# Altium project Zynq7000_Eval_Board.PrjPcb (part 2 of 2)

## Sheet [04] - FPGA - DDR3, DDR3 MEM.SchDoc
size A2; SheetNumber: 4; SheetTotal: 4
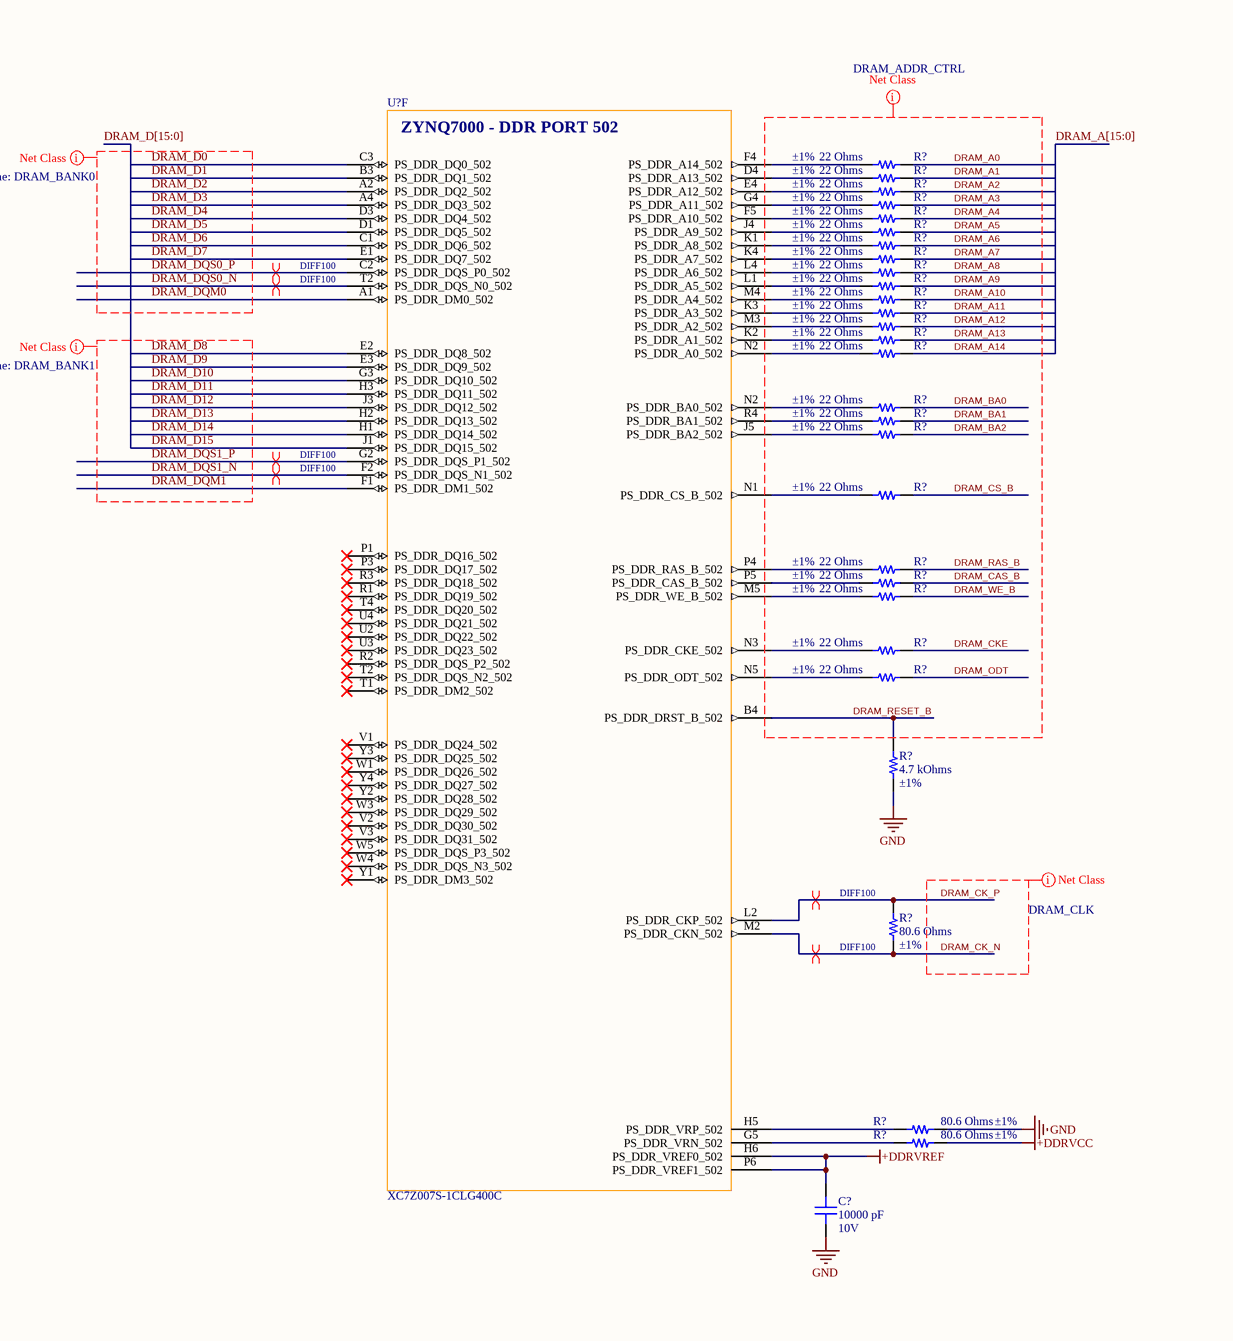
[diagram p3: [04] - FPGA - DDR3, DDR3 MEM.SchDoc, left]
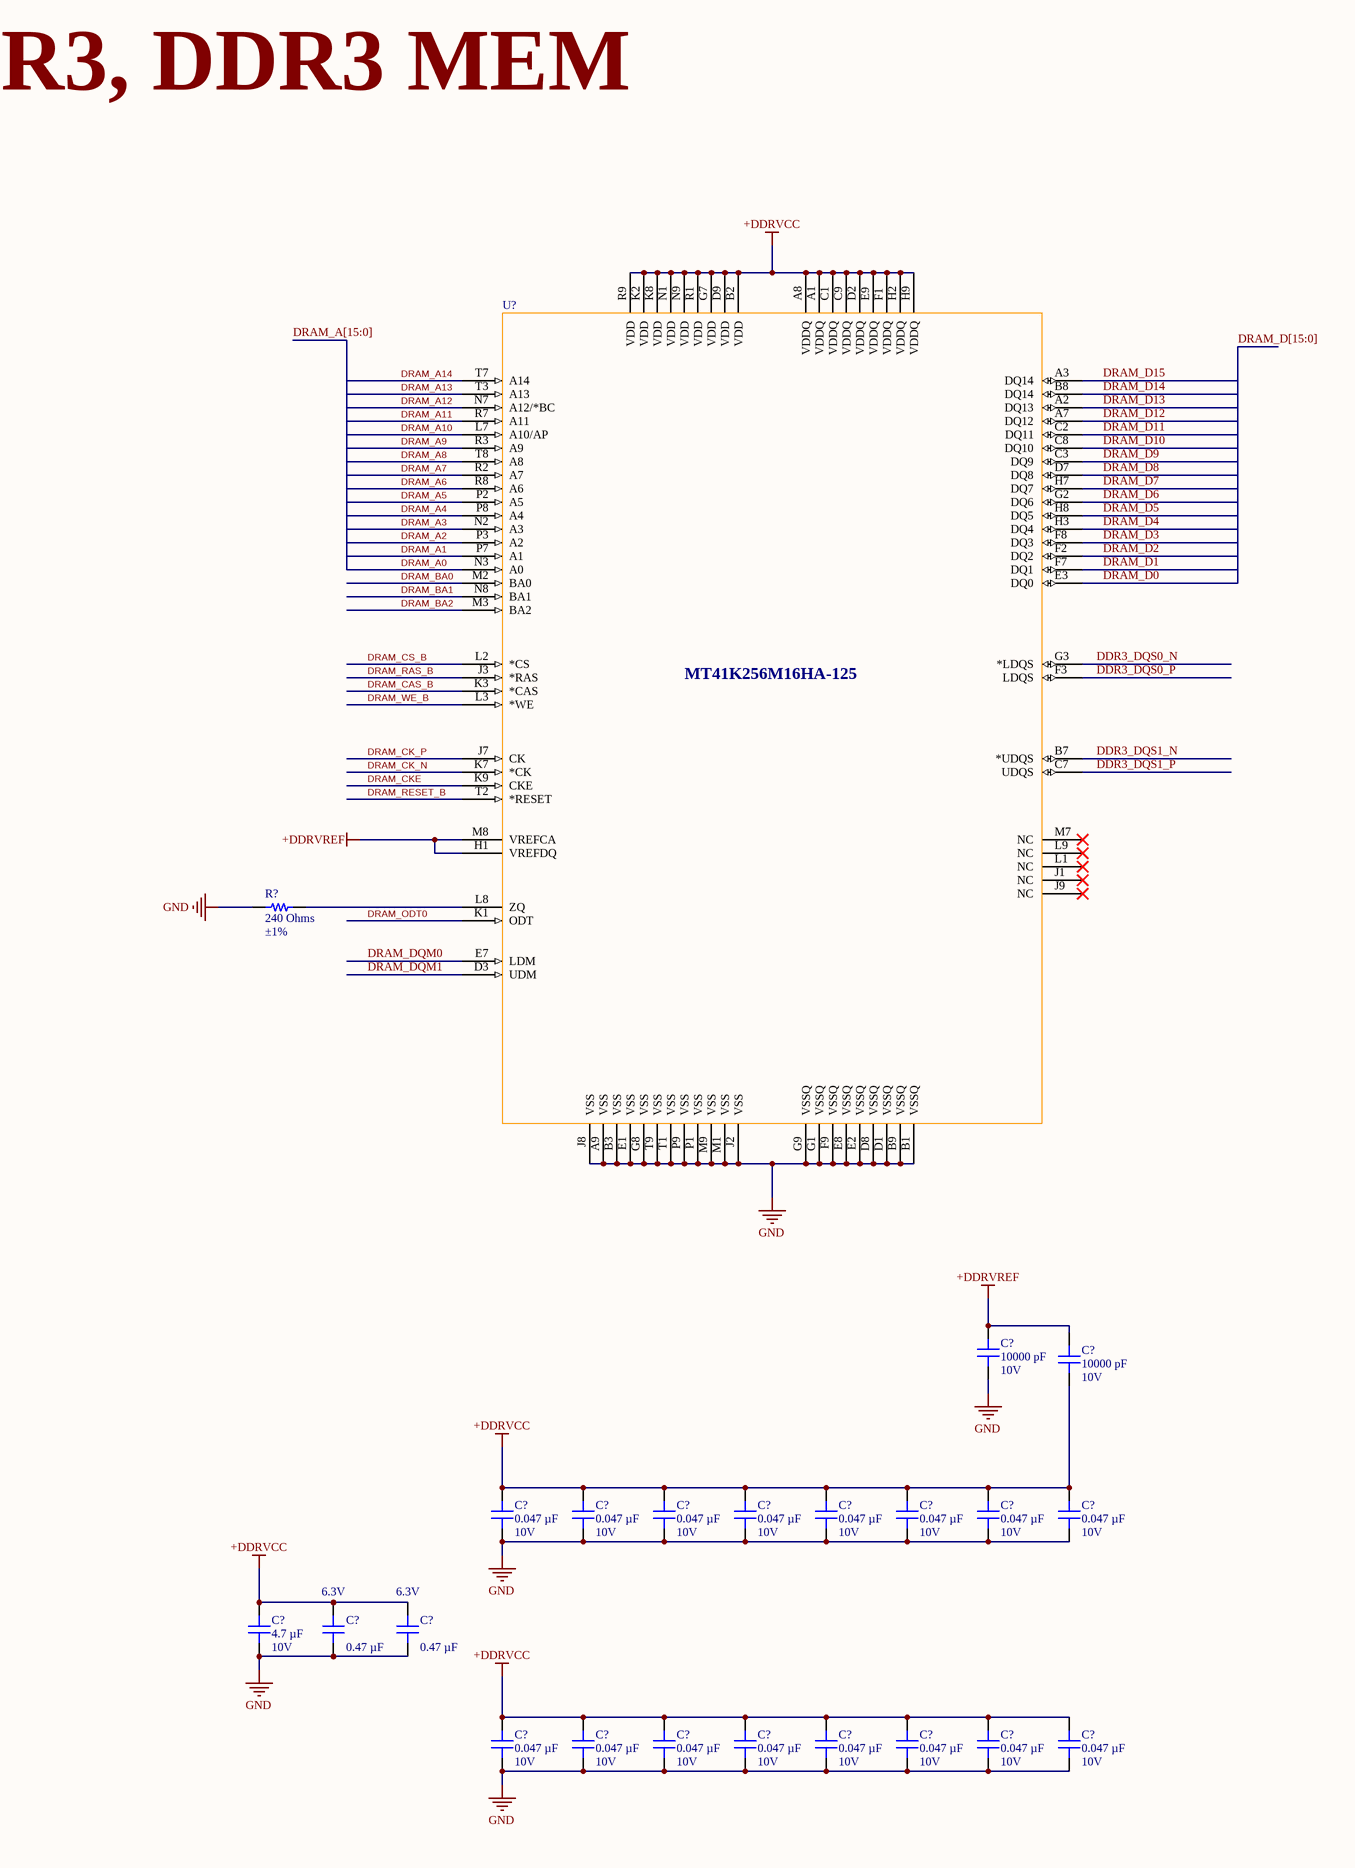
[diagram p4: [04] - FPGA - DDR3, DDR3 MEM.SchDoc, right]

### Parts
(Parts that share a designator on the sheet are numbered #1, #2 ... from top to bottom, then left to right.)
C?#75  Voltage - Rated: 10V  [CAP 0201_0603]  (hidden comment: 10000 pF)
C?#76  Voltage - Rated: 10V  [CAP 0201_0603]  (hidden comment: 10000 pF)
C?#77  Voltage - Rated: 10V  [CAP 0201_0603]  (hidden comment: 10000 pF)
C?#78  Voltage - Rated: 10V  [CAP 0201_0603]  (hidden comment: 0.047 µF)
C?#79  Voltage - Rated: 10V  [CAP 0201_0603]  (hidden comment: 0.047 µF)
C?#80  Voltage - Rated: 10V  [CAP 0201_0603]  (hidden comment: 0.047 µF)
C?#81  Voltage - Rated: 10V  [CAP 0201_0603]  (hidden comment: 0.047 µF)
C?#82  Voltage - Rated: 10V  [CAP 0201_0603]  (hidden comment: 0.047 µF)
C?#83  Voltage - Rated: 10V  [CAP 0201_0603]  (hidden comment: 0.047 µF)
C?#84  Voltage - Rated: 10V  [CAP 0201_0603]  (hidden comment: 0.047 µF)
C?#85  Voltage - Rated: 10V  [CAP 0201_0603]  (hidden comment: 0.047 µF)
C?#86  Voltage - Rated: 10V  [CAP 0402_1005]  (hidden comment: 4.7 µF)
C?#87  Voltage - Rated: 6.3V  [CAP 0201_0603]  (hidden comment: 0.47 µF)
C?#88  Voltage - Rated: 6.3V  [CAP 0201_0603]  (hidden comment: 0.47 µF)
C?#89  Voltage - Rated: 10V  [CAP 0201_0603]  (hidden comment: 0.047 µF)
C?#90  Voltage - Rated: 10V  [CAP 0201_0603]  (hidden comment: 0.047 µF)
C?#91  Voltage - Rated: 10V  [CAP 0201_0603]  (hidden comment: 0.047 µF)
C?#92  Voltage - Rated: 10V  [CAP 0201_0603]  (hidden comment: 0.047 µF)
C?#93  Voltage - Rated: 10V  [CAP 0201_0603]  (hidden comment: 0.047 µF)
C?#94  Voltage - Rated: 10V  [CAP 0201_0603]  (hidden comment: 0.047 µF)
C?#95  Voltage - Rated: 10V  [CAP 0201_0603]  (hidden comment: 0.047 µF)
C?#96  Voltage - Rated: 10V  [CAP 0201_0603]  (hidden comment: 0.047 µF)
R?#21  Tolerance: ±1%  [RES 0201_0603]  (hidden comment: 22 Ohms)
R?#22  Tolerance: ±1%  [RES 0201_0603]  (hidden comment: 22 Ohms)
R?#23  Tolerance: ±1%  [RES 0201_0603]  (hidden comment: 22 Ohms)
R?#24  Tolerance: ±1%  [RES 0201_0603]  (hidden comment: 22 Ohms)
R?#25  Tolerance: ±1%  [RES 0201_0603]  (hidden comment: 22 Ohms)
R?#26  Tolerance: ±1%  [RES 0201_0603]  (hidden comment: 22 Ohms)
R?#27  Tolerance: ±1%  [RES 0201_0603]  (hidden comment: 22 Ohms)
R?#28  Tolerance: ±1%  [RES 0201_0603]  (hidden comment: 22 Ohms)
R?#29  Tolerance: ±1%  [RES 0201_0603]  (hidden comment: 22 Ohms)
R?#30  Tolerance: ±1%  [RES 0201_0603]  (hidden comment: 22 Ohms)
R?#31  Tolerance: ±1%  [RES 0201_0603]  (hidden comment: 22 Ohms)
R?#32  Tolerance: ±1%  [RES 0201_0603]  (hidden comment: 22 Ohms)
R?#33  Tolerance: ±1%  [RES 0201_0603]  (hidden comment: 22 Ohms)
R?#34  Tolerance: ±1%  [RES 0201_0603]  (hidden comment: 22 Ohms)
R?#35  Tolerance: ±1%  [RES 0201_0603]  (hidden comment: 22 Ohms)
R?#36  Tolerance: ±1%  [RES 0201_0603]  (hidden comment: 22 Ohms)
R?#37  Tolerance: ±1%  [RES 0201_0603]  (hidden comment: 22 Ohms)
R?#38  Tolerance: ±1%  [RES 0201_0603]  (hidden comment: 22 Ohms)
R?#39  Tolerance: ±1%  [RES 0201_0603]  (hidden comment: 22 Ohms)
R?#40  Tolerance: ±1%  [RES 0201_0603]  (hidden comment: 22 Ohms)
R?#41  Tolerance: ±1%  [RES 0201_0603]  (hidden comment: 22 Ohms)
R?#42  Tolerance: ±1%  [RES 0201_0603]  (hidden comment: 22 Ohms)
R?#43  Tolerance: ±1%  [RES 0201_0603]  (hidden comment: 22 Ohms)
R?#44  Tolerance: ±1%  [RES 0201_0603]  (hidden comment: 22 Ohms)
R?#45  Tolerance: ±1%  [RES 0402_1005]  (hidden comment: 240 Ohms)
R?#46  Tolerance: ±1%  [RES 0402_1005]  (hidden comment: 4.7 kOhms)
R?#47  Tolerance: ±1%  [RES 0402_1005]  (hidden comment: 80.6 Ohms)
R?#48  Tolerance: ±1%  [RES 0402_1005]  (hidden comment: 80.6 Ohms)
R?#49  Tolerance: ±1%  [RES 0402_1005]  (hidden comment: 80.6 Ohms)
U?#4  XC7Z007S-1CLG400C  [CLG400_XIL]  (part F of 8)
U?#5  MT41K256M16HA-125

### Nets
+DDRVCC: C?#76.1 C?#78.2 C?#79.2 C?#80.2 C?#81.2 C?#82.2 C?#83.2 C?#84.2 C?#85.2 C?#86.2 C?#87.2 C?#88.2 C?#89.2 C?#90.2 C?#91.2 C?#92.2 C?#93.2 C?#94.2 C?#95.2 C?#96.2 R?#49.2 U?#5.A1(VDDQ) U?#5.A8(VDDQ) U?#5.B2(VDD) U?#5.C1(VDDQ) U?#5.C9(VDDQ) U?#5.D2(VDDQ) U?#5.D9(VDD) U?#5.E9(VDDQ) U?#5.F1(VDDQ) U?#5.G7(VDD) U?#5.H2(VDDQ) U?#5.H9(VDDQ) U?#5.K2(VDD) U?#5.K8(VDD) U?#5.N1(VDD) U?#5.N9(VDD) U?#5.R1(VDD) U?#5.R9(VDD)
+DDRVREF: C?#75.2 C?#76.2 C?#77.2 U?#4.H6(PS_DDR_VREF0_502) U?#4.P6(PS_DDR_VREF1_502) U?#5.H1(VREFDQ) U?#5.M8(VREFCA)
GND: C?#75.1 C?#77.1 C?#78.1 C?#79.1 C?#80.1 C?#81.1 C?#82.1 C?#83.1 C?#84.1 C?#85.1 C?#86.1 C?#87.1 C?#88.1 C?#89.1 C?#90.1 C?#91.1 C?#92.1 C?#93.1 C?#94.1 C?#95.1 C?#96.1 R?#45.1 R?#46.2 R?#48.2 U?#5.A9(VSS) U?#5.B1(VSSQ) U?#5.B3(VSS) U?#5.B9(VSSQ) U?#5.D1(VSSQ) U?#5.D8(VSSQ) U?#5.E1(VSS) U?#5.E2(VSSQ) U?#5.E8(VSSQ) U?#5.F9(VSSQ) U?#5.G1(VSSQ) U?#5.G8(VSS) U?#5.G9(VSSQ) U?#5.J2(VSS) U?#5.J8(VSS) U?#5.M1(VSS) U?#5.M9(VSS) U?#5.P1(VSS) U?#5.P9(VSS) U?#5.T1(VSS) U?#5.T9(VSS)
DDR3_DQS0_N: U?#5.G3(*LDQS)
DDR3_DQS0_P: U?#5.F3(LDQS)
DDR3_DQS1_N: U?#5.B7(*UDQS)
DDR3_DQS1_P: U?#5.C7(UDQS)
DRAM_A0: R?#21.1 U?#5.N3(A0)
DRAM_A1: R?#22.1 U?#5.P7(A1)
DRAM_A2: R?#23.1 U?#5.P3(A2)
DRAM_A3: R?#24.1 U?#5.N2(A3)
DRAM_A4: R?#25.1 U?#5.P8(A4)
DRAM_A5: R?#26.1 U?#5.P2(A5)
DRAM_A6: R?#27.1 U?#5.R8(A6)
DRAM_A7: R?#28.1 U?#5.R2(A7)
DRAM_A8: R?#29.1 U?#5.T8(A8)
DRAM_A9: R?#30.1 U?#5.R3(A9)
DRAM_A10: R?#31.1 U?#5.L7(A10/AP)
DRAM_A11: R?#32.1 U?#5.R7(A11)
DRAM_A12: R?#33.1 U?#5.N7(A12/*BC)
DRAM_A13: R?#34.1 U?#5.T3(A13)
DRAM_A14: R?#35.1 U?#5.T7(A14)
DRAM_BA0: R?#36.1 U?#5.M2(BA0)
DRAM_BA1: R?#37.1 U?#5.N8(BA1)
DRAM_BA2: R?#38.1 U?#5.M3(BA2)
DRAM_CAS_B: R?#41.1 U?#5.K3(*CAS)
DRAM_CK_N: R?#47.2 U?#4.M2(PS_DDR_CKN_502) U?#5.K7(*CK)
DRAM_CK_P: R?#47.1 U?#4.L2(PS_DDR_CKP_502) U?#5.J7(CK)
DRAM_CKE: R?#43.1 U?#5.K9(CKE)
DRAM_CS_B: R?#39.1 U?#5.L2(*CS)
DRAM_D0: U?#4.C3(PS_DDR_DQ0_502) U?#5.E3(DQ0)
DRAM_D1: U?#4.B3(PS_DDR_DQ1_502) U?#5.F7(DQ1)
DRAM_D2: U?#4.A2(PS_DDR_DQ2_502) U?#5.F2(DQ2)
DRAM_D3: U?#4.A4(PS_DDR_DQ3_502) U?#5.F8(DQ3)
DRAM_D4: U?#4.D3(PS_DDR_DQ4_502) U?#5.H3(DQ4)
DRAM_D5: U?#4.D1(PS_DDR_DQ5_502) U?#5.H8(DQ5)
DRAM_D6: U?#4.C1(PS_DDR_DQ6_502) U?#5.G2(DQ6)
DRAM_D7: U?#4.E1(PS_DDR_DQ7_502) U?#5.H7(DQ7)
DRAM_D8: U?#4.E2(PS_DDR_DQ8_502) U?#5.D7(DQ8)
DRAM_D9: U?#4.E3(PS_DDR_DQ9_502) U?#5.C3(DQ9)
DRAM_D10: U?#4.G3(PS_DDR_DQ10_502) U?#5.C8(DQ10)
DRAM_D11: U?#4.H3(PS_DDR_DQ11_502) U?#5.C2(DQ11)
DRAM_D12: U?#4.J3(PS_DDR_DQ12_502) U?#5.A7(DQ12)
DRAM_D13: U?#4.H2(PS_DDR_DQ13_502) U?#5.A2(DQ13)
DRAM_D14: U?#4.H1(PS_DDR_DQ14_502) U?#5.B8(DQ14)
DRAM_D15: U?#4.J1(PS_DDR_DQ15_502) U?#5.A3(DQ14)
DRAM_DQM0: U?#4.A1(PS_DDR_DM0_502) U?#5.E7(LDM)
DRAM_DQM1: U?#4.F1(PS_DDR_DM1_502) U?#5.D3(UDM)
DRAM_DQS0_N: U?#4.T2(PS_DDR_DQS_N2_502)
DRAM_DQS0_P: U?#4.C2(PS_DDR_DQS_P0_502)
DRAM_DQS1_N: U?#4.F2(PS_DDR_DQS_N1_502)
DRAM_DQS1_P: U?#4.G2(PS_DDR_DQS_P1_502)
DRAM_ODT: R?#44.1
DRAM_ODT0: U?#5.K1(ODT)
DRAM_RAS_B: R?#40.1 U?#5.J3(*RAS)
DRAM_RESET_B: R?#46.1 U?#4.B4(PS_DDR_DRST_B_502) U?#5.T2(*RESET)
DRAM_WE_B: R?#42.1 U?#5.L3(*WE)
NetR?#21_2: R?#21.2 U?#4.F4(PS_DDR_A14_502)
NetR?#22_2: R?#22.2 U?#4.D4(PS_DDR_A13_502)
NetR?#23_2: R?#23.2 U?#4.E4(PS_DDR_A12_502)
NetR?#24_2: R?#24.2 U?#4.G4(PS_DDR_A11_502)
NetR?#25_2: R?#25.2 U?#4.F5(PS_DDR_A10_502)
NetR?#26_2: R?#26.2 U?#4.J4(PS_DDR_A9_502)
NetR?#27_2: R?#27.2 U?#4.K1(PS_DDR_A8_502)
NetR?#28_2: R?#28.2 U?#4.K4(PS_DDR_A7_502)
NetR?#29_2: R?#29.2 U?#4.L4(PS_DDR_A6_502)
NetR?#30_2: R?#30.2 U?#4.L1(PS_DDR_A5_502)
NetR?#31_2: R?#31.2 U?#4.M4(PS_DDR_A4_502)
NetR?#32_2: R?#32.2 U?#4.K3(PS_DDR_A3_502)
NetR?#33_2: R?#33.2 U?#4.M3(PS_DDR_A2_502)
NetR?#34_2: R?#34.2 U?#4.K2(PS_DDR_A1_502)
NetR?#35_2: R?#35.2 U?#4.N2(PS_DDR_A0_502)
NetR?#36_2: R?#36.2 U?#4.N2(PS_DDR_BA0_502)
NetR?#37_2: R?#37.2 U?#4.R4(PS_DDR_BA1_502)
NetR?#38_2: R?#38.2 U?#4.J5(PS_DDR_BA2_502)
NetR?#39_2: R?#39.2 U?#4.N1(PS_DDR_CS_B_502)
NetR?#40_2: R?#40.2 U?#4.P4(PS_DDR_RAS_B_502)
NetR?#41_2: R?#41.2 U?#4.P5(PS_DDR_CAS_B_502)
NetR?#42_2: R?#42.2 U?#4.M5(PS_DDR_WE_B_502)
NetR?#43_2: R?#43.2 U?#4.N3(PS_DDR_CKE_502)
NetR?#44_2: R?#44.2 U?#4.N5(PS_DDR_ODT_502)
NetR?#45_2: R?#45.2 U?#5.L8(ZQ)
NetR?#48_1: R?#48.1 U?#4.H5(PS_DDR_VRP_502)
NetR?#49_1: R?#49.1 U?#4.G5(PS_DDR_VRN_502)

Not connected (* = marked no-connect by the designer): U?#4 P1(PS_DDR_DQ16_502)* P3(PS_DDR_DQ17_502)* R1(PS_DDR_DQ19_502)* R2(PS_DDR_DQS_P2_502)* R3(PS_DDR_DQ18_502)* T1(PS_DDR_DM2_502)* T4(PS_DDR_DQ20_502)* U2(PS_DDR_DQ22_502)* U3(PS_DDR_DQ23_502)* U4(PS_DDR_DQ21_502)* V1(PS_DDR_DQ24_502)* V2(PS_DDR_DQ30_502)* V3(PS_DDR_DQ31_502)* W1(PS_DDR_DQ26_502)* W3(PS_DDR_DQ29_502)* W4(PS_DDR_DQS_N3_502)* W5(PS_DDR_DQS_P3_502)* Y1(PS_DDR_DM3_502)* Y2(PS_DDR_DQ28_502)* Y3(PS_DDR_DQ25_502)* Y4(PS_DDR_DQ27_502)*; U?#5 J1(NC)* J9(NC)* L1(NC)* L9(NC)* M7(NC)*

### Buses and harness runs
bus DRAM_A[15:0]
bus DRAM_D[15:0]

### Layout directives
Net Class Name: DRAM_ADDR_CTRL: DRAM_A0, DRAM_A1, DRAM_A2, DRAM_A3, DRAM_A4, DRAM_A5, DRAM_A6, DRAM_A7, DRAM_A8, DRAM_A9, DRAM_A10, DRAM_A11, DRAM_A12, DRAM_A13, DRAM_A14, DRAM_BA0, DRAM_BA1, DRAM_BA2, DRAM_CAS_B, DRAM_CKE, DRAM_CS_B, DRAM_ODT, DRAM_RAS_B, DRAM_RESET_B, DRAM_WE_B
Net Class Name: DRAM_BANK0: DRAM_D0, DRAM_D1, DRAM_D2, DRAM_D3, DRAM_D4, DRAM_D5, DRAM_D6, DRAM_D7, DRAM_DQM0, DRAM_DQS0_N, DRAM_DQS0_P
Net Class Name: DRAM_BANK1: DRAM_D8, DRAM_D9, DRAM_D10, DRAM_D11, DRAM_D12, DRAM_D13, DRAM_D14, DRAM_D15, DRAM_DQM1, DRAM_DQS1_N, DRAM_DQS1_P
differential pair; net class DIFF100: DRAM_CK_N, DRAM_CK_P, DRAM_DQS0_N, DRAM_DQS0_P, DRAM_DQS1_N, DRAM_DQS1_P
Net Class Name: DRAM_CLK: DRAM_CK_N, DRAM_CK_P

### Notes on the sheet
- FPGA - DDR3, DDR3 MEM
- (in symbol XC7Z007S-1CLG400C, part F) ZYNQ7000 - DDR PORT 502

### Library data of the parts
C?#75-C?#77 = MAASL063SB7103MFCA01: CAP CER 0.01UF 10V X7R 0201; manufacturer: Taiyo Yuden; Tolerance: ±20%; Part Number: MAASL063SB7103MFCA01; Value: 10000 pF; Applications: Automotive; Capacitance: 10000 pF; componentlink1description: Datasheet; componentlink1url: https://media.digikey.com/pdf/Data%20Sheets/Taiyo%20Yuden%20PDFs%20URL%20links/MAASL063SB7103MFCA01_SS.pdf; componentlink2description: DigiKey Link; componentlink2url: https://www.digikey.com/en/products/detail/taiyo-yuden/MAASL063SB7103MFCA01/18109005; Device Package: 0201 (0603 Metric); Height - Seated (Max): 0.013" (0.33mm); lastupdated: 27.04.2023 19:00:59; Lifecycle Status: Active; Minimum Order: 1; Mounting Type: Surface Mount, MLCC; Operating Temperature: -55°C ~ 125°C; Package / Case: 0201 (0603 Metric); packaging: TapeAndReel; partid: 47946; Part Status: Active; price: 0.01; Ratings: AEC-Q200; series: MAAS; Size / Dimension: 0.024" L x 0.012" W (0.60mm x 0.30mm); Supplier 1: DigiKey; Supplier Part Number 1: 587-MAASL063SB7103MFCA01CT-ND; Temperature Coefficient: X7R; Thickness (Max): 0.013" (0.33mm)
C?#78-C?#85 C?#89-C?#96 = LMK063BJ473KP-F: CAP CER 0.047UF 10V X5R 0201; manufacturer: Taiyo Yuden; Tolerance: ±10%; Part Number: LMK063BJ473KP-F; Value: 0.047 µF; Applications: SMPS Filtering; Capacitance: 0.047 µF; componentlink1description: Datasheet; componentlink1url: https://ds.yuden.co.jp/TYCOMPAS/ut/detail?pn=LMK063BJ473KP-F  &u=M; componentlink2description: DigiKey Link; componentlink2url: https://www.digikey.com/en/products/detail/taiyo-yuden/LMK063BJ473KP-F/2002857; Device Package: 0201 (0603 Metric); lastupdated: 27.04.2023 19:01:19; Lifecycle Status: Active; Minimum Order: 1; Mounting Type: Surface Mount, MLCC; Operating Temperature: -55°C ~ 85°C; Package / Case: 0201 (0603 Metric); packaging: TapeAndReel; partid: 223; Part Status: Active; price: 0.01; series: M; Size / Dimension: 0.024" L x 0.012" W (0.60mm x 0.30mm); Supplier 1: DigiKey; Supplier Part Number 1: 587-2242-1-ND; Temperature Coefficient: X5R; Thickness (Max): 0.013" (0.33mm)
C?#86 = GMC04X5R475K10NT: CAP0402 X5R 4.7UF 10% 10V; manufacturer: Cal-Chip Electronics, Inc.; Part Number: GMC04X5R475K10NT; Value: 4.7 µF; Applications: General Purpose; Capacitance: 4.7 µF; componentlink1description: Datasheet; componentlink1url: https://88ce57.p3cdn1.secureserver.net/wp-content/uploads/2023/01/gmc_series-2.pdf; componentlink2description: DigiKey Link; componentlink2url: https://www.digikey.com/en/products/detail/cal-chip-electronics-inc/GMC04X5R475K10NT/18151135; Device Package: 0402 (1005 Metric); lastupdated: 26.04.2023 19:01:59; Lifecycle Status: Active; Minimum Order: 1; Mounting Type: Surface Mount, MLCC; Operating Temperature: -55°C ~ 85°C; Package / Case: 0402 (1005 Metric); packaging: TapeAndReel; partid: 49814; Part Status: Active; price: 0.01; series: GMC; Size / Dimension: 0.039" L x 0.020" W (1.00mm x 0.50mm); Supplier 1: DigiKey; Supplier Part Number 1: 4713-GMC04X5R475K10NTCT-ND; Temperature Coefficient: X5R; Thickness (Max): 0.028" (0.70mm); Tolerance: ±10%
C?#87 C?#88 = JMK063BC6474KP-F: CAP CER 0.47UF 6.3V X6S 0201; manufacturer: Taiyo Yuden; Tolerance: ±10%; Part Number: JMK063BC6474KP-F; Value: 0.47 µF; Applications: SMPS Filtering; Capacitance: 0.47 µF; componentlink1description: Datasheet; componentlink1url: https://ds.yuden.co.jp/TYCOMPAS/ut/detail?pn=JMK063BC6474KP-F&u=M; componentlink2description: DigiKey Link; componentlink2url: https://www.digikey.com/en/products/detail/taiyo-yuden/JMK063BC6474KP-F/9947925; Device Package: 0201 (0603 Metric); lastupdated: 26.04.2023 19:00:46; Lifecycle Status: Active; Minimum Order: 1; Mounting Type: Surface Mount, MLCC; Operating Temperature: -55°C ~ 105°C; Package / Case: 0201 (0603 Metric); packaging: TapeAndReel; partid: 108; Part Status: Active; price: 0.01; series: M; Size / Dimension: 0.024" L x 0.012" W (0.60mm x 0.30mm); Supplier 1: DigiKey; Supplier Part Number 1: 587-6386-1-ND; Temperature Coefficient: X6S; Thickness (Max): 0.015" (0.39mm)
R?#21-R?#44 = ERJ-1GNF22R0C: RES SMD 22 OHM 1% 1/20W 0201; Manufacturer: Panasonic Electronic Components; Power (Watts): 0.05W, 1/20W; Temperature Coefficient: ±200ppm/°C; Part Number: ERJ-1GNF22R0C; Value: 22 Ohms; ComponentLink1Description: Datasheet; ComponentLink1URL: https://industrial.panasonic.com/cdbs/www-data/pdf/RDA0000/AOA0000C304.pdf; ComponentLink2Description: DigiKey Link; ComponentLink2URL: https://www.digikey.com/en/products/detail/panasonic-electronic-components/ERJ-1GNF22R0C/2035920; Composition: Thick Film; Device Package: 0201 (0603 Metric); Features: Automotive AEC-Q200; Height - Seated (Max): 0.010" (0.26mm); LastUpdated: 29.04.2023 19:19:39; Lifecycle Status: Active; Minimum Order: 1; Number of Terminations: 2; Operating Temperature: -55°C ~ 125°C; Package / Case: 0201 (0603 Metric); Packaging: TapeAndReel; PartId: 823; Part Status: Active; Price: 0.01; Ratings: AEC-Q200; Resistance: 22 Ohms; Series: ERJ-1GN; Size / Dimension: 0.024" L x 0.012" W (0.60mm x 0.30mm); Supplier 1: DigiKey; Supplier Part Number 1: P122843CT-ND; Supplier Device Package: 0201
R?#45 = RMCF0402FT240R: RES 240 OHM 1% 1/16W 0402; Manufacturer: Stackpole Electronics Inc; Power (Watts): 0.063W, 1/16W; Temperature Coefficient: ±100ppm/°C; Part Number: RMCF0402FT240R; Value: 240 Ohms; ComponentLink1Description: Datasheet; ComponentLink1URL: https://www.seielect.com/catalog/sei-rmcf_rmcp.pdf; ComponentLink2Description: DigiKey Link; ComponentLink2URL: https://www.digikey.com/en/products/detail/stackpole-electronics-inc/RMCF0402FT240R/2417437; Composition: Thick Film; Device Package: 0402 (1005 Metric); Features: Automotive AEC-Q200; Height - Seated (Max): 0.016" (0.40mm); LastUpdated: 1.05.2023 19:23:08; Lifecycle Status: Active; Minimum Order: 1; Number of Terminations: 2; Operating Temperature: -55°C ~ 155°C; Package / Case: 0402 (1005 Metric); Packaging: CutTape; PartId: 4938; Part Status: Active; Price: 0.01; Ratings: AEC-Q200; Resistance: 240 Ohms; Series: RMCF; Size / Dimension: 0.039" L x 0.020" W (1.00mm x 0.50mm); Supplier 1: DigiKey; Supplier Part Number 1: RMCF0402FT240RCT-ND; Supplier Device Package: 0402
R?#46 = RT0402FRE074K7L: RES SMD 4.7K OHM 1% 1/16W 0402; Manufacturer: Yageo; Power (Watts): 0.063W, 1/16W; Temperature Coefficient: ±50ppm/°C; Part Number: RT0402FRE074K7L; Value: 4.7 kOhms; ComponentLink1Description: Datasheet; ComponentLink1URL: https://www.yageo.com/upload/media/product/productsearch/datasheet/rchip/PYu-RT_1-to-0.01_RoHS_L_11.pdf; ComponentLink2Description: DigiKey Link; ComponentLink2URL: https://www.digikey.com/en/products/detail/yageo/RT0402FRE074K7L/1072052; Composition: Thin Film; Device Package: 0402 (1005 Metric); Height - Seated (Max): 0.014" (0.35mm); LastUpdated: 1.05.2023 19:23:11; Lifecycle Status: Active; Minimum Order: 1; Number of Terminations: 2; Operating Temperature: -55°C ~ 155°C; Package / Case: 0402 (1005 Metric); Packaging: TapeAndReel; PartId: 3198; Part Status: Active; Price: 0.01; Resistance: 4.7 kOhms; Series: RT; Size / Dimension: 0.039" L x 0.020" W (1.00mm x 0.50mm); Supplier 1: DigiKey; Supplier Part Number 1: YAG3347CT-ND; Supplier Device Package: 0402
R?#47-R?#49 = CRCW040280R6FKED: RES SMD 80.6 OHM 1% 1/16W 0402; Manufacturer: Vishay Dale; Power (Watts): 0.063W, 1/16W; Temperature Coefficient: ±100ppm/°C; Part Number: CRCW040280R6FKED; Value: 80.6 Ohms; ComponentLink1Description: Datasheet; ComponentLink1URL: http://www.vishay.com/docs/20035/dcrcwe3.pdf; ComponentLink2Description: DigiKey Link; ComponentLink2URL: https://www.digikey.com/en/products/detail/vishay-dale/CRCW040280R6FKED/1177882; Composition: Thick Film; Device Package: 0402 (1005 Metric); Features: Automotive AEC-Q200; Height - Seated (Max): 0.016" (0.40mm); LastUpdated: 1.05.2023 19:23:04; Lifecycle Status: Active; Minimum Order: 1; Number of Terminations: 2; Operating Temperature: -55°C ~ 155°C; Package / Case: 0402 (1005 Metric); Packaging: CutTape; PartId: 7140; Part Status: Active; Price: 0.01; Ratings: AEC-Q200; Resistance: 80.6 Ohms; Series: CRCW; Size / Dimension: 0.039" L x 0.020" W (1.00mm x 0.50mm); Supplier 1: DigiKey; Supplier Part Number 1: 541-80.6LCT-ND; Supplier Device Package: 0402
U?#4 = XC7Z007S-1CLG400C: No Description Available; Mfr_Name: Xilinx Inc; RefDes: RefDes; Type: Type

## Sheet [05] - FPGA - USB HOST.SchDoc
size A3; SheetNumber: 5; SheetTotal: 5
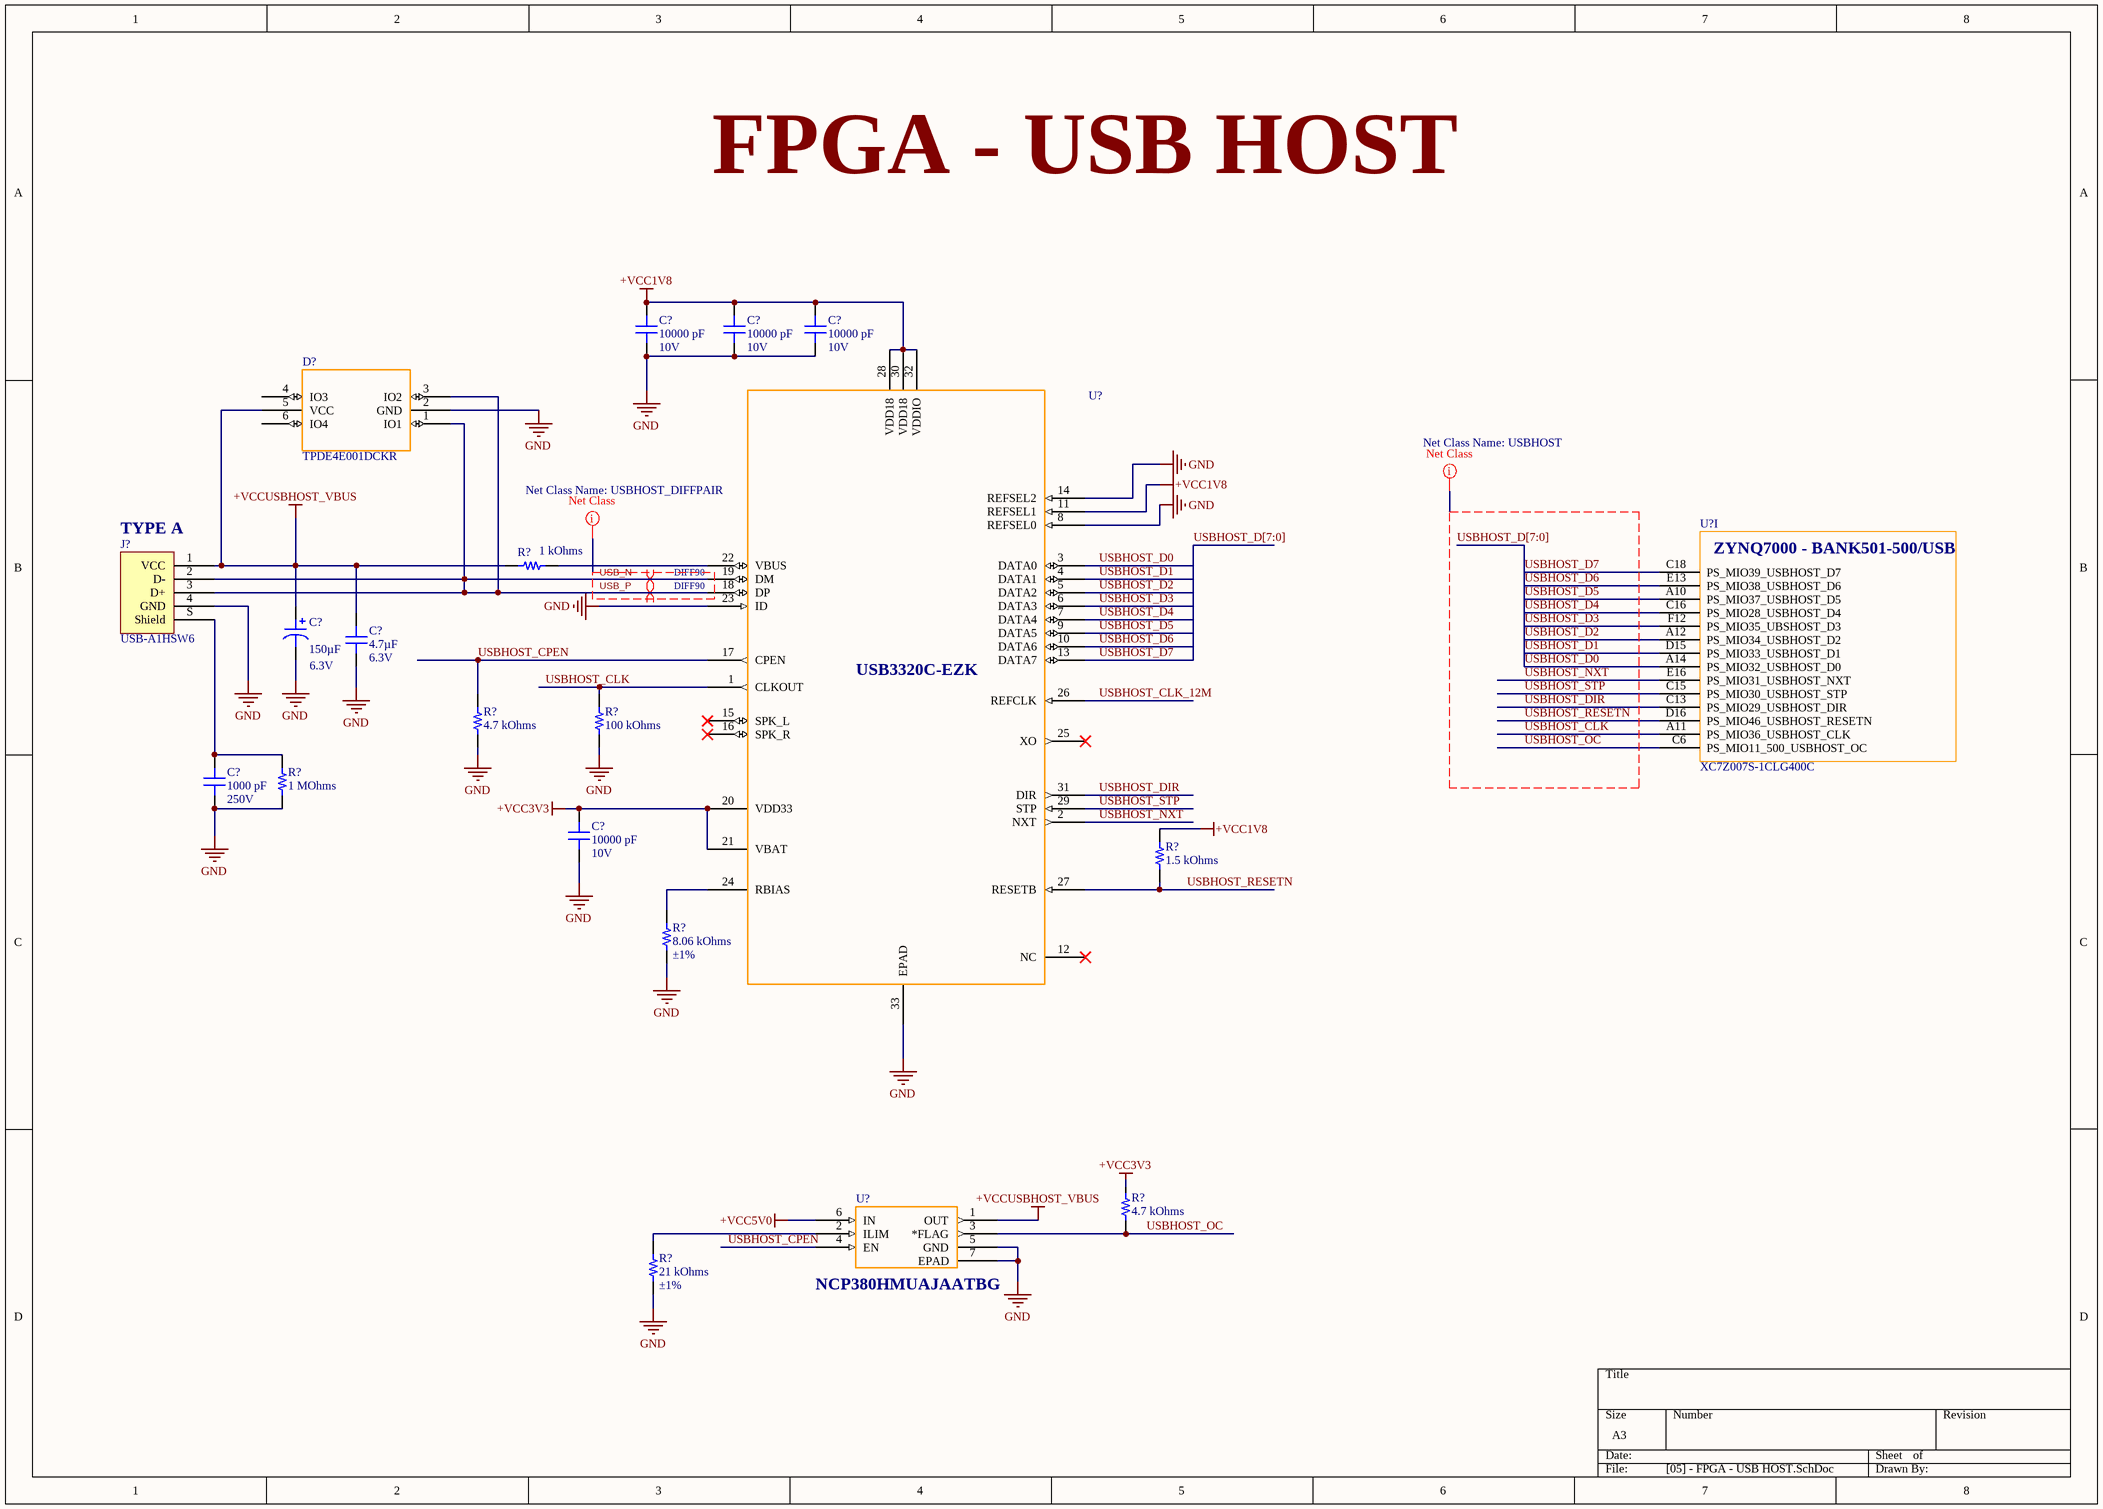
[diagram p5: [05] - FPGA - USB HOST.SchDoc]

### Parts
(Parts that share a designator on the sheet are numbered #1, #2 ... from top to bottom, then left to right.)
C?#97  Voltage - Rated: 10V  [CAP 0201_0603]  (hidden comment: 10000 pF)
C?#98  Voltage - Rated: 10V  [CAP 0201_0603]  (hidden comment: 10000 pF)
C?#99  Voltage - Rated: 10V  [CAP 0201_0603]  (hidden comment: 10000 pF)
C?#100  Voltage - Rated: 6.3V  [CAP POL 1411_3528]  (hidden comment: 150µF)
C?#101  Voltage - Rated: 6.3V  [CAP 0603_1608]  (hidden comment: 4.7µF)
C?#102  Voltage - Rated: 250V  [CAP 0805_2012]  (hidden comment: 1000 pF)
C?#103  Voltage - Rated: 10V  [CAP 0201_0603]  (hidden comment: 10000 pF)
D?#2  TPDE4E001DCKR  [TPDE4E001DCKR]
J?#2  USB-A1HSW6  [ON SHORE TECHNOLOGY USB-A1HSW6]
R?#50  1 kOhms  [RES 0201_0603]
R?#51  Resistance: 4.7 kOhms  [RES 0201_0603]  (hidden comment: RC0603J472CS)
R?#52  100 kOhms  [RES 0201_0603]
R?#53  1 MOhms  [RES 0402_1005]
R?#54  1.5 kOhms  [RES 0201_0603]
R?#55  Tolerance: ±1%  [RES 0201_0603]  (hidden comment: 8.06 kOhms)
R?#56  Resistance: 4.7 kOhms  [RES 0201_0603]  (hidden comment: RC0603J472CS)
R?#57  Tolerance: ±1%  [RES 0201_0603]  (hidden comment: 21 kOhms)
U?#6  USB3320C-EZK  [USB3320C-EZK]  (value not drawn)
U?#7  XC7Z007S-1CLG400C  [CLG400_XIL]  (part I of 9)
U?#8  NCP380HMUAJAATBG  [NCP380HMUAJAATBG]

### Nets
+VCC1V8: C?#97.2 C?#98.2 C?#99.2 R?#54.1 U?#6.11(REFSEL1) U?#6.28(VDD18) U?#6.30(VDD18) U?#6.32(VDDIO)
+VCC3V3: C?#103.2 R?#56.2 U?#6.20(VDD33) U?#6.21(VBAT)
+VCC5V0: U?#8.6(IN)
+VCCUSBHOST_VBUS: C?#100.1 C?#101.1 D?#2.5(VCC) J?#2.1(VCC) R?#50.2 U?#8.1(OUT)
GND: C?#97.1 C?#98.1 C?#99.1 C?#100.2 C?#101.2 C?#102.1 C?#103.1 D?#2.2(GND) J?#2.4(GND) R?#51.1 R?#52.1 R?#53.1 R?#55.1 R?#57.1 U?#6.8(REFSEL0) U?#6.14(REFSEL2) U?#6.23(ID) U?#6.33(EPAD) U?#8.5(GND) U?#8.7(EPAD)
USB_N: D?#2.1(IO1) D?#2.3(IO2) J?#2.2(D-) J?#2.3(D+) U?#6.18(DP) U?#6.19(DM)  [also labelled USB_P]
USBHOST_CLK: R?#52.2 U?#6.1(CLKOUT) U?#7.A11(PS_MIO36_USBHOST_CLK)
USBHOST_CLK_12M: U?#6.26(REFCLK)
USBHOST_CPEN: R?#51.2 U?#6.17(CPEN) U?#8.4(EN)
USBHOST_D0: U?#6.3(DATA0) U?#7.A14(PS_MIO32_USBHOST_D0)
USBHOST_D1: U?#6.4(DATA1) U?#7.D15(PS_MIO33_USBHOST_D1)
USBHOST_D2: U?#6.5(DATA2) U?#7.A12(PS_MIO34_USBHOST_D2)
USBHOST_D3: U?#6.6(DATA3) U?#7.F12(PS_MIO35_UBSHOST_D3)
USBHOST_D4: U?#6.7(DATA4) U?#7.C16(PS_MIO28_USBHOST_D4)
USBHOST_D5: U?#6.9(DATA5) U?#7.A10(PS_MIO37_USBHOST_D5)
USBHOST_D6: U?#6.10(DATA6) U?#7.E13(PS_MIO38_USBHOST_D6)
USBHOST_D7: U?#6.13(DATA7) U?#7.C18(PS_MIO39_USBHOST_D7)
USBHOST_DIR: U?#6.31(DIR) U?#7.C13(PS_MIO29_USBHOST_DIR)
USBHOST_NXT: U?#6.2(NXT) U?#7.E16(PS_MIO31_USBHOST_NXT)
USBHOST_OC: R?#56.1 U?#7.C6(PS_MIO11_500_USBHOST_OC) U?#8.3(*FLAG)
USBHOST_RESETN: R?#54.2 U?#6.27(RESETB) U?#7.D16(PS_MIO46_USBHOST_RESETN)
USBHOST_STP: U?#6.29(STP) U?#7.C15(PS_MIO30_USBHOST_STP)
NetC?#102_2: C?#102.2 J?#2.S(Shield) R?#53.2
NetR?#50_1: R?#50.1 U?#6.22(VBUS)
NetR?#55_2: R?#55.2 U?#6.24(RBIAS)
NetR?#57_2: R?#57.2 U?#8.2(ILIM)

Not connected (* = marked no-connect by the designer): D?#2 4(IO3) 6(IO4); U?#6 12(NC)* 15(SPK_L)* 16(SPK_R)* 25(XO)*

### Buses and harness runs
bus USBHOST_D[7:0]

### Layout directives
differential pair; net class DIFF90: USB_N
Net Class Name: USBHOST: (no net found under the mark)
Net Class Name: USBHOST_DIFFPAIR: (no net found under the mark)

### Notes on the sheet
- FPGA - USB HOST
- (near J?#2) TYPE A
- (near U?#6) USB3320C-EZK
- (in symbol XC7Z007S-1CLG400C, part I) ZYNQ7000 - BANK501-500/USB

### Library data of the parts
C?#97-C?#99 C?#103 = MAASL063SB7103MFCA01: as C?#75 on sheet [04] - FPGA - DDR3, DDR3 MEM; Part Number: MAASL063SB7103MFCA01; Value: 10000 pF; Applications: Automotive; Capacitance: 10000 pF; componentlink1description: Datasheet; componentlink1url: https://media.digikey.com/pdf/Data%20Sheets/Taiyo%20Yuden%20PDFs%20URL%20links/MAASL063SB7103MFCA01_SS.pdf; componentlink2description: DigiKey Link; componentlink2url: https://www.digikey.com/en/products/detail/taiyo-yuden/MAASL063SB7103MFCA01/18109005; Device Package: 0201 (0603 Metric); Height - Seated (Max): 0.013" (0.33mm); lastupdated: 27.04.2023 19:00:59; Lifecycle Status: Active; Minimum Order: 1; Mounting Type: Surface Mount, MLCC; Operating Temperature: -55°C ~ 125°C; Package / Case: 0201 (0603 Metric); packaging: TapeAndReel; partid: 47946; Part Status: Active; price: 0.01; Ratings: AEC-Q200; series: MAAS; Size / Dimension: 0.024" L x 0.012" W (0.60mm x 0.30mm); Supplier 1: DigiKey; Supplier Part Number 1: 587-MAASL063SB7103MFCA01CT-ND; Temperature Coefficient: X7R; Thickness (Max): 0.013" (0.33mm)
C?#100 = TLJH157M006R0900: CAP TANT 150UF 20% 6.3V 1411; manufacturer: AVX Corporation; Manufacturer Size Code: H; ESR (Equivalent Series Resistance): 900mOhm; Type: Molded; Part Number: TLJH157M006R0900; Value: 150µF; Capacitance: 150µF; componentlink1description: Datasheet; componentlink1url: http://datasheets.avx.com/TLJ.pdf; componentlink2description: DigiKey Link; componentlink2url: http://digikey.com/product-detail/en/avx-corporation/TLJH157M006R0900/478-5347-1-ND/1957565; Features: General Purpose; Height - Seated (Max): 0.059" (1.50mm); lastupdated: 2.09.2020 01:15:46; Lifecycle Status: Active; Minimum Order: 1; Mounting Type: Surface Mount; Operating Temperature: -55°C ~ 125°C; Package / Case: 1411 (3528 Metric), 1210; packaging: TapeAndReel; partid: 14; Part Status: Active; price: 0.52; series: TLJ; Size / Dimension: 0.138" L x 0.110" W (3.50mm x 2.80mm); Supplier 1: DigiKey; Supplier Part Number 1: 478-5347-1-ND; Tolerance: ±20%
C?#101 = 06036D475KAT4A: CAP CER 4.7UF 6.3V X5R 0603; manufacturer: AVX Corporation; Tolerance: ±10%; Part Number: 06036D475KAT4A; Value: 4.7µF; Applications: General Purpose; Capacitance: 4.7µF; componentlink1description: Datasheet; componentlink1url: http://datasheets.avx.com/cx5r.pdf; componentlink2description: DigiKey Link; componentlink2url: http://digikey.com/product-detail/en/avx-corporation/06036D475KAT4A/478-10813-1-ND/7536337; Device Package: 0603 (1608 Metric); lastupdated: 2.09.2020 01:03:34; Lifecycle Status: Active; Minimum Order: 1; Mounting Type: Surface Mount, MLCC; Operating Temperature: -55°C ~ 85°C; Package / Case: 0603 (1608 Metric); packaging: TapeAndReel; partid: 2929; Part Status: Active; price: 0.02; series: -; Size / Dimension: 0.063" L x 0.032" W (1.60mm x 0.81mm); Supplier 1: DigiKey; Supplier Part Number 1: 478-10813-1-ND; Temperature Coefficient: X5R; Thickness (Max): 0.037" (0.94mm)
C?#102 = C0805C102FAGECAUTO: CAP CER 0805 1NF 250V C0G 1%; manufacturer: KEMET; Temperature Coefficient: C0G, NP0; Part Number: C0805C102FAGECAUTO; Value: 1000 pF; Applications: Automotive, ESD Protection; Capacitance: 1000 pF; componentlink1description: Datasheet; componentlink1url: https://connect.kemet.com:7667/gateway/IntelliData-ComponentDocumentation/1.0/download/datasheet/C0805C102FAGECAUTO; componentlink2description: DigiKey Link; componentlink2url: https://www.digikey.com/en/products/detail/kemet/C0805C102FAGECAUTO/8647301; Device Package: 0805 (2012 Metric); Features: Low ESL; lastupdated: 2.05.2023 19:12:16; Lifecycle Status: Active; Minimum Order: 1; Mounting Type: Surface Mount, MLCC; Operating Temperature: -55°C ~ 125°C; Package / Case: 0805 (2012 Metric); packaging: TapeAndReel; partid: 49020; Part Status: Active; price: 0.32; Ratings: AEC-Q200; series: ESD SMD Auto C0G; Size / Dimension: 0.079" L x 0.049" W (2.00mm x 1.25mm); Supplier 1: DigiKey; Supplier Part Number 1: 399-C0805C102FAGECAUTOCT-ND; Thickness (Max): 0.039" (1.00mm); Tolerance: ±1%
J?#2 = USB-A1HSW6: CONN RCPT TYPEA 4POS R/A; Manufacturer: On Shore Technology Inc.; Connector Type: USB - A; Current Rating (Amps): 1A; Gender: Receptacle; Number of Contacts: 4; Number of Ports: 1; Shielding: Unshielded; Voltage - Rated: 30VAC; Part Number: USB-A1HSW6; ComponentLink1Description: Datasheet; ComponentLink1URL: http://www.on-shore.com/wp-content/uploads/USB-A1HSXX.pdf; ComponentLink2Description: DigiKey Link; ComponentLink2URL: http://digikey.com/product-detail/en/on-shore-technology-inc/USB-A1HSW6/ED2989-ND/2677750; Features: Board Lock; LastUpdated: 30.04.2020 11:56:44; Lifecycle Status: Active; Minimum Order: 1; Mounting Feature: Horizontal; Mounting Type: Through Hole, Right Angle; Operating Temperature: 0°C ~ 85°C; Packaging: Tray; Part Status: Active; Price: 0.48; Series: -; Supplier 1: DigiKey; Supplier Part Number 1: ED2989-ND; Termination: Solder
R?#50 = RMCF0201JT1K00: RES 1K OHM 5% 1/20W 0201; Manufacturer: Stackpole Electronics Inc; Power (Watts): 0.05W, 1/20W; Temperature Coefficient: ±200ppm/°C; Part Number: RMCF0201JT1K00; Value: 1 kOhms; ComponentLink1Description: Datasheet; ComponentLink1URL: https://www.seielect.com/catalog/sei-rmcf_rmcp.pdf; ComponentLink2Description: DigiKey Link; ComponentLink2URL: https://www.digikey.com/en/products/detail/stackpole-electronics-inc/RMCF0201JT1K00/1714962; Composition: Thick Film; Device Package: 0201 (0603 Metric); Height - Seated (Max): 0.011" (0.28mm); LastUpdated: 2.05.2023 19:18:53; Lifecycle Status: Active; Minimum Order: 1; Number of Terminations: 2; Operating Temperature: -55°C ~ 155°C; Package / Case: 0201 (0603 Metric); Packaging: CutTape; PartId: 791; Part Status: Active; Price: 0.01; Ratings: AEC-Q200; Resistance: 1 kOhms; Series: RMCF; Size / Dimension: 0.024" L x 0.012" W (0.60mm x 0.30mm); Supplier 1: DigiKey; Supplier Part Number 1: 738-RMCF0201JT1K00CT-ND; Supplier Device Package: 0201; Tolerance: ±5%
R?#51 R?#56 = RC0603J472CS: RES SMD 4.7K OHM 5% 1/20W 0201; Manufacturer: Samsung Electro-Mechanics; Power (Watts): 0.05W, 1/20W; Temperature Coefficient: ±250ppm/°C; Part Number: RC0603J472CS; ComponentLink1Description: Datasheet; ComponentLink1URL: http://www.samsungsem.com/kr/support/product-search/chip-resistor/__icsFiles/afieldfile/2019/01/21/RC_Spec_Sheet(1901).pdf; ComponentLink2Description: DigiKey Link; ComponentLink2URL: https://www.digikey.com/en/products/detail/samsung-electro-mechanics/RC0603J472CS/3964117; Composition: Thick Film; Device Package: 0201 (0603 Metric); Features: Moisture Resistant; Height - Seated (Max): 0.010" (0.26mm); LastUpdated: 2.05.2023 19:18:28; Lifecycle Status: Active; Minimum Order: 15000; Number of Terminations: 2; Operating Temperature: -55°C ~ 125°C; Package / Case: 0201 (0603 Metric); PartId: 66832; Part Status: Active; Price: 0; Series: RC; Size / Dimension: 0.024" L x 0.012" W (0.60mm x 0.30mm); Supplier 1: DigiKey; Supplier Part Number 1: 1276-3810-1-ND; Supplier Device Package: 0201; Tolerance: ±5%
R?#52 = RMCF0201JT100K: RES 100K OHM 5% 1/20W 0201; Manufacturer: Stackpole Electronics Inc; Power (Watts): 0.05W, 1/20W; Temperature Coefficient: ±200ppm/°C; Part Number: RMCF0201JT100K; Value: 100 kOhms; ComponentLink1Description: Datasheet; ComponentLink1URL: https://www.seielect.com/catalog/sei-rmcf_rmcp.pdf; ComponentLink2Description: DigiKey Link; ComponentLink2URL: https://www.digikey.com/en/products/detail/stackpole-electronics-inc/RMCF0201JT100K/1714959; Composition: Thick Film; Device Package: 0201 (0603 Metric); Height - Seated (Max): 0.011" (0.28mm); LastUpdated: 2.05.2023 19:18:53; Lifecycle Status: Active; Minimum Order: 1; Number of Terminations: 2; Operating Temperature: -55°C ~ 155°C; Package / Case: 0201 (0603 Metric); Packaging: CutTape; PartId: 808; Part Status: Active; Price: 0.01; Ratings: AEC-Q200; Resistance: 100 kOhms; Series: RMCF; Size / Dimension: 0.024" L x 0.012" W (0.60mm x 0.30mm); Supplier 1: DigiKey; Supplier Part Number 1: RMCF0201JT100KCT-ND; Supplier Device Package: 0201; Tolerance: ±5%
R?#53 = RK73H1ETTP1004D: RES 1M OHM 0.5% 1/10W 0402; Manufacturer: KOA Speer Electronics, Inc.; Power (Watts): 0.1W, 1/10W; Temperature Coefficient: ±100ppm/°C; Part Number: RK73H1ETTP1004D; Value: 1 MOhms; ComponentLink1Description: Datasheet; ComponentLink1URL: https://www.koaspeer.com/pdfs/RK73H.pdf; ComponentLink2Description: DigiKey Link; ComponentLink2URL: https://www.digikey.com/en/products/detail/koa-speer-electronics-inc/RK73H1ETTP1004D/9853534; Composition: Thick Film; Device Package: 0402 (1005 Metric); Features: Automotive AEC-Q200, Moisture Resistant; Height - Seated (Max): 0.016" (0.40mm); LastUpdated: 2.05.2023 19:23:50; Lifecycle Status: Active; Minimum Order: 1000; Number of Terminations: 2; Operating Temperature: -55°C ~ 155°C; Package / Case: 0402 (1005 Metric); Packaging: TapeAndReel; PartId: 70036; Part Status: Active; Price: 0.03; Ratings: AEC-Q200; Resistance: 1 MOhms; Series: RK73H; Size / Dimension: 0.039" L x 0.020" W (1.00mm x 0.50mm); Supplier 1: DigiKey; Supplier Part Number 1: 2019-RK73H1ETTP1004DCT-ND; Supplier Device Package: 0402; Tolerance: ±0.5%
R?#54 = CRCW02011K50JNED: RES SMD 1.5K OHM 5% 1/20W 0201; Manufacturer: Vishay Dale; Power (Watts): 0.05W, 1/20W; Temperature Coefficient: ±200ppm/°C; Part Number: CRCW02011K50JNED; Value: 1.5 kOhms; ComponentLink1Description: Datasheet; ComponentLink1URL: http://www.vishay.com/docs/20052/crcw0201e3.pdf; ComponentLink2Description: DigiKey Link; ComponentLink2URL: http://digikey.com/product-detail/en/vishay-dale/CRCW02011K50JNED/541-CRCW02011K50JNEDCT-ND/10449419; Composition: Thick Film; Device Package: 0201 (0603 Metric); Height - Seated (Max): 0.011" (0.28mm); LastUpdated: 2.05.2023 19:18:55; Lifecycle Status: Active; Minimum Order: 1; Number of Terminations: 2; Operating Temperature: -55°C ~ 155°C; Package / Case: 0201 (0603 Metric); Packaging: CutTape; PartId: 491; Part Status: Active; Price: 0.10; Resistance: 1.5 kOhms; Series: CRCW; Size / Dimension: 0.024" L x 0.012" W (0.60mm x 0.30mm); Supplier 1: DigiKey; Supplier Part Number 1: 541-CRCW02011K50JNEDCT-ND; Supplier Device Package: 0201; Tolerance: ±5%
R?#55 = AC0201FR-078K06L: RES SMD 8.06K OHM 1% 1/20W 0201; Manufacturer: Yageo; Power (Watts): 0.05W, 1/20W; Temperature Coefficient: ±200ppm/°C; Part Number: AC0201FR-078K06L; Value: 8.06 kOhms; ComponentLink1Description: Datasheet; ComponentLink1URL: https://www.yageo.com/upload/media/product/productsearch/datasheet/rchip/PYu-AC_51_RoHS_L_7.pdf; ComponentLink2Description: DigiKey Link; ComponentLink2URL: https://www.digikey.com/en/products/detail/yageo/AC0201FR-078K06L/5894847; Composition: Thick Film; Device Package: 0201 (0603 Metric); Features: Automotive AEC-Q200, Moisture Resistant; Height - Seated (Max): 0.010" (0.26mm); LastUpdated: 2.05.2023 19:18:51; Lifecycle Status: Active; Minimum Order: 1; Number of Terminations: 2; Operating Temperature: -55°C ~ 155°C; Package / Case: 0201 (0603 Metric); Packaging: TapeAndReel; PartId: 994; Part Status: Active; Price: 0.01; Ratings: AEC-Q200; Resistance: 8.06 kOhms; Series: AC; Size / Dimension: 0.024" L x 0.012" W (0.60mm x 0.30mm); Supplier 1: DigiKey; Supplier Part Number 1: YAG5244CT-ND; Supplier Device Package: 0201
R?#57 = RK73H1HTTC2102F: RES 21K OHM 1% 1/20W 0201; Manufacturer: KOA Speer Electronics, Inc.; Power (Watts): 0.05W, 1/20W; Temperature Coefficient: ±200ppm/°C; Part Number: RK73H1HTTC2102F; Value: 21 kOhms; ComponentLink1Description: Datasheet; ComponentLink1URL: https://www.koaspeer.com/pdfs/RK73H.pdf; ComponentLink2Description: DigiKey Link; ComponentLink2URL: https://www.digikey.com/en/products/detail/koa-speer-electronics-inc/RK73H1HTTC2102F/9850277; Composition: Thick Film; Device Package: 0201 (0603 Metric); Features: Automotive AEC-Q200, Moisture Resistant; Height - Seated (Max): 0.010" (0.26mm); LastUpdated: 2.05.2023 19:18:22; Lifecycle Status: Active; Minimum Order: 1; Number of Terminations: 2; Operating Temperature: -55°C ~ 155°C; Package / Case: 0201 (0603 Metric); Packaging: TapeAndReel; PartId: 64518; Part Status: Active; Price: 0.01; Ratings: AEC-Q200; Resistance: 21 kOhms; Series: RK73H; Size / Dimension: 0.024" L x 0.012" W (0.60mm x 0.30mm); Supplier 1: DigiKey; Supplier Part Number 1: 2019-RK73H1HTTC2102FCT-ND; Supplier Device Package: 0201
U?#7 = XC7Z007S-1CLG400C: as U?#4 on sheet [04] - FPGA - DDR3, DDR3 MEM; RefDes: RefDes; Type: Type

## Nets that join several sheets
+DDRVCC: [02] - POWER (5 pins), [03] - FPGA - POWER (16 pins), [04] - FPGA - DDR3, DDR3 MEM (39 pins)
+DDRVREF: [02] - POWER (C?#24.2 R?#11.1 R?#17.2), [04] - FPGA - DDR3, DDR3 MEM (7 pins)
+VCC1V8: [02] - POWER (5 pins), [03] - FPGA - POWER (21 pins), [05] - FPGA - USB HOST (8 pins)
+VCC3V3: [02] - POWER (8 pins), [03] - FPGA - POWER (37 pins), [05] - FPGA - USB HOST (C?#103.2 R?#56.2 U?#6.20 U?#6.21)
+VCCINT: [02] - POWER (C?#8.2 C?#9.2 L?#1.1 U?#1.26), [03] - FPGA - POWER (16 pins)
GND: [02] - POWER (45 pins), [03] - FPGA - POWER (106 pins), [04] - FPGA - DDR3, DDR3 MEM (45 pins), [05] - FPGA - USB HOST (20 pins)